# Altium schematic sheet Stepper Motor Driver.SchDoc
size A
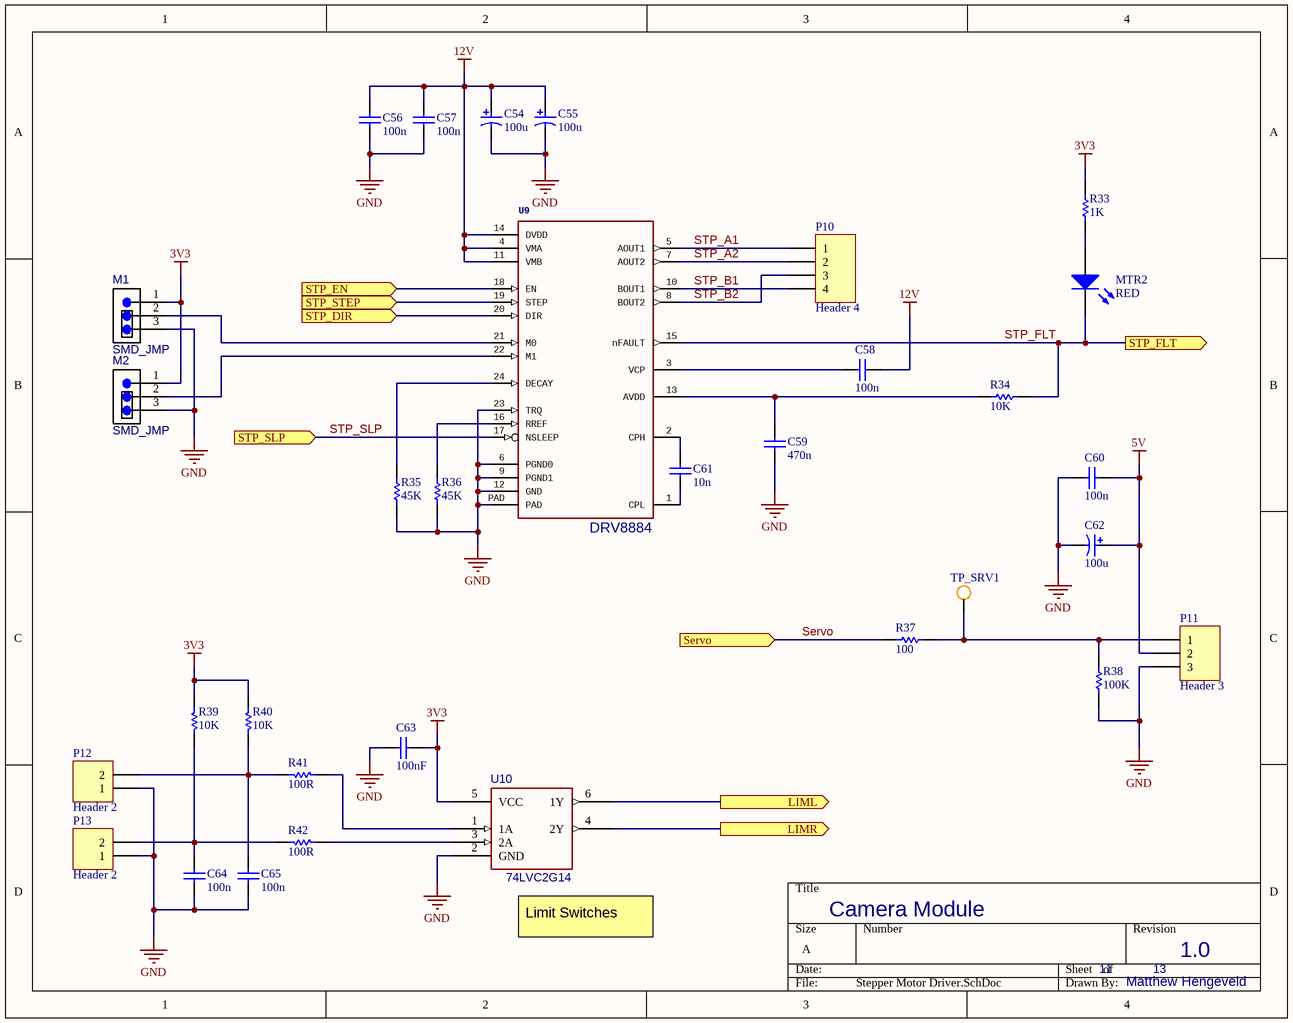
[diagram p0: Stepper Motor Driver.SchDoc]

## Parts
C54  100u  [SMD-CAP-0606]
C55  100u  [SMD-CAP-0606]
C56  100n  [CAPC1608X87X35LL15T15]
C57  100n  [CAPC1608X87X35LL15T15]
C58  100n  [CAPC1608X87X35LL15T15]
C59  470n  [CAPC1608X90X35LL10T15]
C60  100n  [CAPC1608X87X35LL15T15]
C61  10n  [CAPC1608X87X35LL15T15]
C62  100u  [SMD-CAP-0606]
C63  100nF  [CAPC1608X92X38LL15T08]
C64  100n  [CAPC1608X87X35LL15T15]
C65  100n  [CAPC1608X87X35LL15T15]
M1  SMD_JMP  [0603_JUMPER]
M2  SMD_JMP  [0603_JUMPER]
MTR2  RED  [0805_A]
P10  Header 4  [HDR1X4]
P11  Header 3  [HDR1X3]
P12  Header 2  [HDR1X2]
P13  Header 2  [HDR1X2]
R33  1K  [RESC1608X55X30LL15T15]
R34  10K  [RESC1608X55X30LL15T15]
R35  45K  [RESC1608X55X30LL15T15]
R36  45K  [RESC1608X55X30LL15T15]
R37  100  [RESC1608X55X30LL15T15]
R38  100K  [RESC1608X55X30LL15T15]
R39  10K  [RESC1608X55X30LL15T15]
R40  10K  [RESC1608X55X30LL15T15]
R41  100R  [RESC1608X55X30LL15T15]
R42  100R  [RESC1608X55X30LL15T15]
TP_SRV1  Test point  [SMD Test Hook]  (value not drawn)
U9  DRV8884  [TI-PWP24]  (value not drawn)
U10  74LVC2G14  [ONSC-SOT-363-6-419B-02_V]  (value not drawn)

## Ports
LIML (out), LIMR (out), Servo (in), STP_DIR (in), STP_EN (in), STP_FLT (out), STP_SLP (in), STP_STEP (in)

## Nets
3V3: C63.2 M1.1 M2.1 R33.1 R39.1 R40.1 U10.5(VCC)
5V: C60.1 C62.1 P11.2
12V: C54.1 C55.1 C56.2 C57.2 C58.1 U9.4(VMA) U9.11(VMB) U9.14(DVDD)
GND: C54.2 C55.2 C56.1 C57.1 C59.1 C60.2 C62.2 C63.1 C64.2 C65.2 M1.3 M2.3 P11.3 P12.1 P13.1 R35.2 R36.2 R38.2 U9.6(PGND0) U9.9(PGND1) U9.12(GND) U9.23(TRQ) U9.PAD U10.2(GND)
LIML: U10.6(1Y) ; port LIML
LIMR: U10.4(2Y) ; port LIMR
Servo: R37.2 ; port Servo
STP_A1: P10.1 U9.5(AOUT1)
STP_A2: P10.2 U9.7(AOUT2)
STP_B1: P10.4 U9.10(BOUT1)
STP_B2: P10.3 U9.8(BOUT2)
STP_DIR: U9.20(DIR) ; port STP_DIR
STP_EN: U9.18(EN) ; port STP_EN
STP_FLT: MTR2.1(K) R34.2 U9.15(nFAULT) ; port STP_FLT
STP_SLP: U9.17(NSLEEP) ; port STP_SLP
STP_STEP: U9.19(STEP) ; port STP_STEP
NetC58_2: C58.2 U9.3(VCP)
NetC59_2: C59.2 R34.1 U9.13(AVDD)
NetC61_1: C61.1 U9.1(CPL)
NetC61_2: C61.2 U9.2(CPH)
NetC64_1: C64.1 P13.2 R39.2 R42.1
NetC65_1: C65.1 P12.2 R40.2 R41.1
NetM1_2: M1.2 U9.21(M0)
NetM2_2: M2.2 U9.22(M1)
NetMTR2_2: MTR2.2(A) R33.2
NetP11_1: P11.1 R37.1 R38.1 TP_SRV1.1(point)
NetR35_1: R35.1 U9.24(DECAY)
NetR36_1: R36.1 U9.16(RREF)
NetR41_2: R41.2 U10.1(1A)
NetR42_2: R42.2 U10.3(2A)

## Notes on the sheet
- (near U9) DRV8884
- (near U10) Limit Switches
- Camera Module
- 11
- 13
- 1.0
- Matthew Hengeveld

## Library data of the parts
C54 C55 C62 = CAP-EL-0606-SMD: Aluminum Electrolytic Capacitor, UD Series, Low Impedance, 100 uF, 35 V, + / - 20%, -55 to 105 degC, Chip Type, 8 x 10 mm D x L, Pb-Free, Reel; PartNumber: UUD1V101MNL1GS; Manufacturer: Nichicon; Rated Ripple Current (at 100kHz): 450 mA; Packing: Dia382mm Reel; Endurance Time: 5000 h; Impedance: 0.17 Ohm; Rated Voltage: 35 V; Rated Capacitance: 100 uF; Tolerance Rated Capacitance: -20 to 20%; ComponentLink2URL: http://products.nichicon.co.jp/en/pdf/XJA043/e-ud.pdf; DatasheetVersion: 08/2012; ComponentLink1Description: Manufacturer URL; Diameter: 8 mm; RoHS: TRUE; ComponentLink3Description: Package Specification; Mounting Technology: Surface Mount; ComponentLink3URL: http://products.nichicon.co.jp/en/pdf/XJA043/e-ud.pdf; Length: 10 mm; PackageReference: CAPAE-D8H10; ComponentLink1URL: http://www.nichicon.co.jp/; ComponentLink2Description: Datasheet; PackageDescription: 2-Pin Surface Mount Device, Diameter 8 mm, Height 10 mm, Pitch 6.5 mm
C56-C58 C60 C64 C65 = CMP-2006-03300-1: Part Number: C0603X104K5RACTU; Manufacturer: Kemet
C59 = CMP-2006-02860-1: Manufacturer: Murata; Part Number: GRM188R71C474KA88D
C61 = CMP-2006-03036-1: Manufacturer: Kemet; Part Number: C0603C103K1RACTU
C63 = CMP-2006-01974-1: Part Number: VJ0603Y104KNXAO; Manufacturer: Vitramon
MTR2 = CMP-1426-00011-1: SMD mono-color Chip LED, WL-SMCW, Red; PartNumber: 150080RS75000; Manufacturer: Wuerth Elektronik; Color: Red; PackageReference: 0805_A; ComponentLink2Description: Datasheet; ComponentLink1URL: http://www.we-online.com; ComponentLink1Description: Manufacturer URL; ComponentLink2URL: http://katalog.we-online.com/led/datasheet/150080RS75000.pdf
P10 = Header 4: Header, 4-Pin; LatestRevisionDate: 17-Jul-2002; LatestRevisionNote: Re-released for DXP Platform.; Publisher: Altium Limited
P11 = Header 3: Header, 3-Pin; LatestRevisionDate: 17-Jul-2002; LatestRevisionNote: Re-released for DXP Platform.; Publisher: Altium Limited
P12 P13 = Header 2: Header, 2-Pin; LatestRevisionDate: 17-Jul-2002; LatestRevisionNote: Re-released for DXP Platform.; Publisher: Altium Limited
R33-R42 = CMP-2000-00704-1: Manufacturer: Panasonic; Part Number: ERJ-3GEYJ103V
U9 = DRV8884: GateName_1: G$1; SymbolName_1: DRV8843; LibraryName: DRV88xx; DeviceSetName: DRV8843; Package: HTSSOP28PWP